# EAGLE design Grove - High Temperature Sensor v1.0 (EAGLE 6.4)
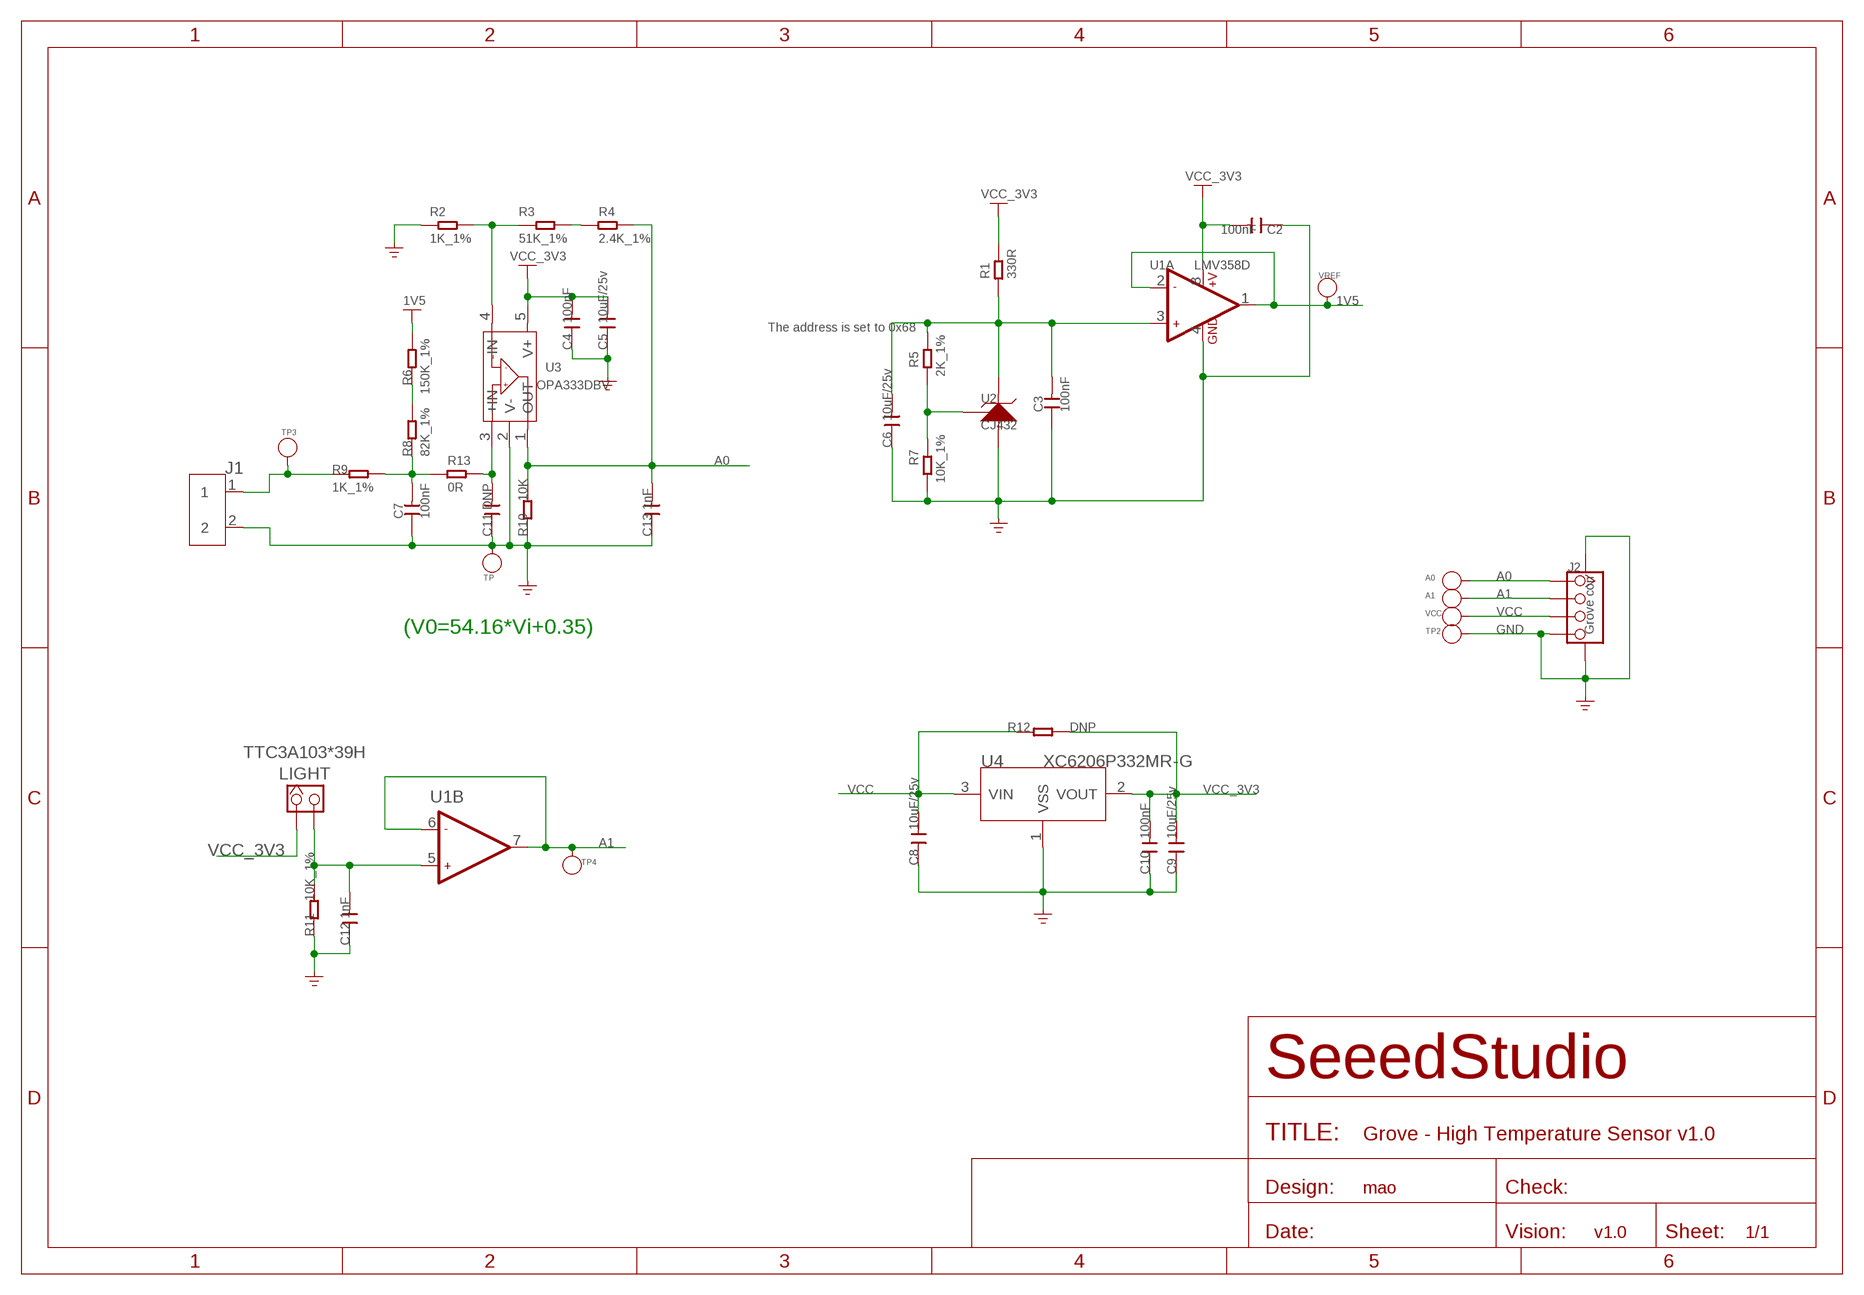
[diagram p0: schematic, sheet 1]

## Parts
A0  TP3  PAD-TEST-POINT'4545'  [TP_4545]
A1  TP3  PAD-TEST-POINT'4545'  [TP_4545]
C2  100nF  C-0603  [C0603]
C3  100nF  C-0603  [C0603]
C4  100nF  C-0603  [C0603]
C5  10uF/25v  C-0805  [C0805]
C6  10uF/25v  C-0805  [C0805]
C7  100nF  C-0603  [C0603]
C8  10uF/25v  C-0805  [C0805]
C9  10uF/25v  C-0805  [C0805]
C10  100nF  C-0603  [C0603]
C11  DNP  C-0603  [C0603]
C12  1nF  C-0603  [C0603]
C13  1nF  C-0603  [C0603]
J1  SCREW-TERMINAL-2P'3.5'  [2P-3.5]
J2  Grove con  TWIG-4P-2.0-SMD-FEMALE-REINFORCE'DD'  [4P-SMD-2.0]
LIGHT  TTC3A103*39H  HEADER_1X2_2.54  [CK_1*2]
R1  330R  R-0603  [R0603]
R2  1K_1%  R-0603  [R0603]
R3  51K_1%  R-0603  [R0603]
R4  2.4K_1%  R-0603  [R0603]
R5  2K_1%  R-0603  [R0603]
R6  150K_1%  R-0603  [R0603]
R7  10K_1%  R-0603  [R0603]
R8  82K_1%  R-0603  [R0603]
R9  1K_1%  R-0603  [R0603]
R10  10K  R-0603  [R0603]
R11  10K_1%  R-0603  [R0603]
R12  DNP  R-0603  [R0603]
R13  0R  R-0603  [R0603]
TP  PAD-TEST-POINT'4545'  [TP_4545]
TP2  PAD-TEST-POINT'4545'  [TP_4545]
TP3  PAD-TEST-POINT'4545'  [TP_4545]
TP4  PAD-TEST-POINT'4545'  [TP_4545]
U1  LMV358D  [SO08]
U2  CJ432  REFERENCE-SOURCE  [SOT23]
U3  OPA333DBV  [SOT23-5]
U4  XC6206P332MR-G  XC6206MR  [SOT23]
VCC  TP2  PAD-TEST-POINT'4545'  [TP_4545]
VREF  TP4  PAD-TEST-POINT'4545'  [TP_4545]

## Nets
1V5: R6.2 U1.1(A:OUT1) U1.2(A:-IN1) VREF.T ; supply symbol labelled POWER_BAR
A0: A0.T C13.2 J2.1 R4.1 R10.2 U3.1(OUT)
A1: A1.T J2.2 TP4.T U1.6(B:-IN2) U1.7(B:OUT2)
GND: C2.1 C3.1 C4.1 C5.1 C6.1 C7.1 C8.1 C9.1 C10.1 C11.1 C12.1 C13.1 J1.2 J2.4 J2.SS1 J2.SS2 R2.2 R7.2 R10.1 R11.1 TP2.T TP.T U1.4(A:GND) U2.3(A) U3.2(V-) U4.1(VSS)
N$1: C7.2 R8.1 R9.2 R13.2
N$2: R2.1 R3.2 U3.4(-IN)
N$3: J1.1 R9.1 TP3.T
N$4: R3.1 R4.2
N$5: C12.2 LIGHT.2 R11.2 U1.5(B:+IN2)
N$6: R6.1 R8.2
N$7: C11.2 R13.1 U3.3(+IN)
N$22: R5.2 R7.1 U2.1(R)
VCC: C8.2 J2.3 R12.1 U4.3(VIN) VCC.T
VCC_3V3: C2.2 C4.2 C5.2 C9.2 C10.2 LIGHT.1 R1.1 R12.2 U1.8(A:+V) U3.5(V+) U4.2(VOUT) ; supply symbol labelled POWER_BAR
VREF: C3.2 C6.2 R1.2 R5.1 U1.3(A:+IN1) U2.2(K)

## Notes on the sheet
- The address is set to 0x68
- (V0=54.16*Vi+0.35)
- mao
- v1.0

## Library data of the parts
A0 A1 TP TP2-TP4 VCC VREF = Discrete:PAD-TEST-POINT; PARTNO: DNP
C2-C13 = Discrete:C*: Ceramic Capacitors
J1 = Connector :SCREW-TERMINAL-2P
J2 = Connector :TWIG-4P-2.0-SMD-FEMALE-REINFORCE
LIGHT = CONNECTER:HEADER_1X2
R1-R13 = Discrete:R*
U1 = IC:LMV358: General purpose LOW Voltage, Rail-to-Rail Output Amplifiers http://www.fairchildsemi.com/ds/LM/LMV358.pdf
U2 = For_Test_Albert_v6:REFERENCE-SOURCE: CJ432,AZ432 or other Adjustable Reference Source
U3 = IC:OPA333: 1.8V,Micro power CMOS oprational amplifiers Zero-Drift Series http://www.ti.com.cn/cn/lit/ds/symlink/opa333.pdf
U4 = IC:XC6206: LOW ESR Cap.Compatible Positive Voltage Regulators

## Net classes
0 default: width 0.152 mm, drill 0.305 mm, clearance 0.152 mm
1 pwr: width 0.152 mm, drill 0.305 mm, clearance 0.152 mm

## Board
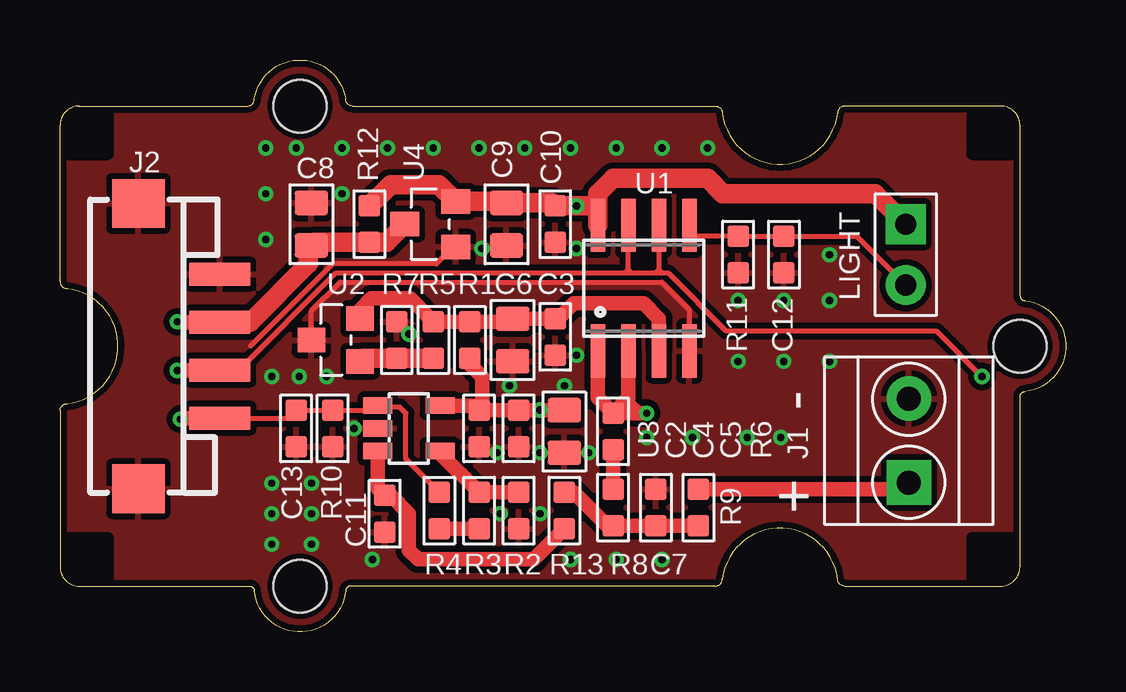
[diagram p1: board, top side]
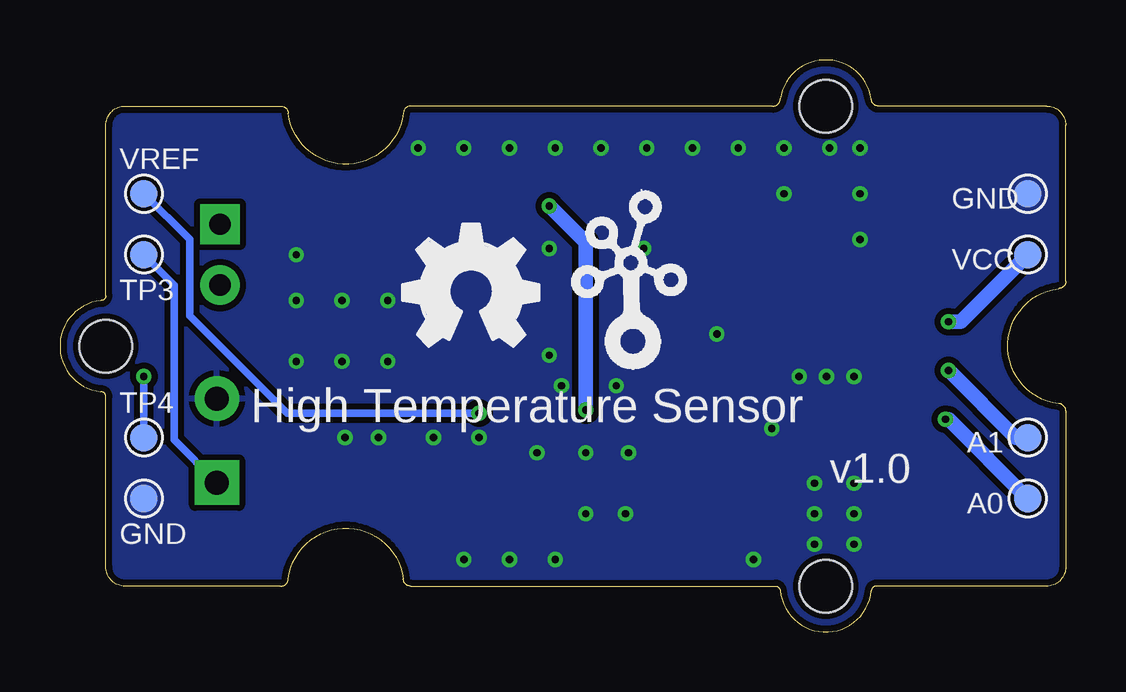
[diagram p2: board, bottom side, seen from below]

Size 41.91 x 23.83 mm. Coordinates in mm from the lower left corner, seen from the top.
Copper layers (1*16): Top 0.035mm / dielectric 1.5mm / Bottom 0.035mm
Design rules "SeeedStudio_DRU_no_angle_20130527 *": minimum track width 6mil, minimum drill 12mil, track to track 6mil, track to pad 6mil, pad to pad 6mil, via to via 6mil, smd to smd 0mil, copper to edge 10mil, drill to drill 10mil, minimum pad ring 10mil, minimum via ring 6mil, stop-mask expansion 2mil, vias tented up to drill 100mil, thermal gap 10mil

### Footprints (pad centres in the part's own frame; a part is rotated, then mirrored left to right if it is on the bottom)
TP_4545 = smd 1.143 x 1.143: T 0,0
C0603 = smd 0.889 x 0.889: 1 -0.762,0; 2 0.762,0
C0805 = smd 1.016 x 1.397: 1 -0.889,0; 2 0.889,0
2P-3.5 = drill 1 pad 1.85 square: 1 -1.75,0 | drill 1 pad 1.85: 2 1.75,0
4P-SMD-2.0 = smd 0.965 x 2.54: 1 -3,0; 2 -1,0; 3 1,0; 4 3,0 | smd 2.032 x 2.184: SS1 -5.946,3.4; SS2 5.946,3.4
CK_1*2 = drill 0.889 pad 1.651 square: 1 0,1.27 | drill 0.889 pad 1.651: 2 0,-1.27
R0603 = smd 0.889 x 0.889: 1 -0.762,0; 2 0.762,0
SO08 = smd 0.61 x 2.21: 1 -1.905,-2.616; 2 -0.635,-2.616; 3 0.635,-2.616; 4 1.905,-2.616; 5 1.905,2.616; 6 0.635,2.616; 7 -0.635,2.616; 8 -1.905,2.616
SOT23 = smd 1.016 x 1.143: 1 -0.889,-1.016; 2 0.889,-1.016; 3 0,1.016
SOT23-5 = smd 0.69 x 1.2: 1 -0.95,-1.3; 2 0,-1.3; 3 0.95,-1.3; 4 0.95,1.3; 5 -0.95,1.3
SOT23' = smd 1.016 x 1.2: 1 -0.95,-1.06; 2 0.95,-1.06; 3 0,1.06
GROVE-2CONNECTOR-SMD = hole 2.2: -10,-10; -10,10; 20,0

### Placement (x,y rotation side)
A0  1.59,5.56 0 bottom
A1  1.59,8.1 0 bottom
C2  17.46,8.48 90 top
C3  20.64,12.29 90 top
C4  19.11,8.48 90 top
C5  21.02,8.35 90 top
C6  18.86,12.16 90 top
C7  24.83,5.18 270 top
C8  10.47,16.99 270 top
C9  18.6,16.99 90 top
C10  20.64,16.99 90 top
C11  13.52,4.92 90 top
C12  30.16,15.72 90 top
C13  9.84,8.48 90 top
J1  35.37,7.97 90 top
J2  6.66,11.91 90 top
LIGHT  35.24,15.72 0 top
R1  17.08,12.16 90 top
R2  19.11,5.05 270 top
R3  17.46,5.05 90 top
R4  15.81,5.05 270 top
R5  15.55,12.16 270 top
R6  23.05,8.35 90 top
R7  14.03,12.16 90 top
R8  23.05,5.18 90 top
R9  26.6,5.18 270 top
R10  11.36,8.48 90 top
R11  28.26,15.72 90 top
R12  12.89,16.99 90 top
R13  21.02,5.05 90 top
TP  38.41,5.56 0 bottom
TP2  1.59,18.26 0 bottom
TP3  38.41,15.72 0 bottom
TP4  38.41,8.1 0 bottom
U1  24.32,14.32 0 top
U2  11.49,12.16 90 top
U3  14.54,8.48 270 top
U4  XC6206P332MR-G  [SOT23']  15.43,16.99 90 top
U$9  [GROVE-2CONNECTOR-SMD]  20,11.91 0 top
U$11  [TWIGLOGO]  18.09,11.91 0 bottom
U$12  [OSHW_FILLX200_NOTEXT]  27.62,11.91 0 bottom
VCC  1.59,15.72 0 bottom
VREF  38.41,18.26 0 bottom

### Tracks (layer width: path | path; a pad name or v marks a point on that pad's centre or on a via)
1V5  (via drill 0.3 pad 0.64)
  Top 0.61: U1.2 23.68,9.75 | 23.68,9.75 R6.2 | U1.1 22.41,9.75 R6.2 | R6.2 23.68,9.11 | 24.06,9.11 v24.45,9.11 | 23.68,9.5 23.68,9.11 | 23.68,9.75 23.68,9.5 | 23.68,9.5 24.06,9.11 | 24.06,9.11 23.68,9.11
  Bottom 0.305: v24.45,9.11 32.45,9.11 36.51,13.18 36.51,16.35 VREF.T
A0  (via drill 0.3 pad 0.64)
  Top 0.203: R10.2 13.05,9.24 U3.1 13.3,9.37 14.16,9.37 14.41,9.11 14.41,7.21 R4.1 | 11.03,8.91 R10.2 | R10.2 C13.2 9.84,8.91 J2.1
  Top 0.61: J2.1 5.06,8.91 v5.01,8.86
  Bottom 0.61: v5.01,8.86 4.89,8.86 A0.T
A1  (via drill 0.3 pad 0.64)
  Top 0.203: J2.2 7.44,10.91 11.49,14.96 23.56,14.96 | 23.56,14.96 23.81,14.96 | 23.81,14.96 24.83,14.96 | 24.83,14.96 24.95,14.96 | 23.68,15.08 U1.7 | 23.68,15.08 23.56,14.96 | 23.68,15.08 23.81,14.96 | U1.6 24.95,15.08 | 24.95,15.08 24.95,14.96 | 25.08,14.96 25.33,14.96 27.75,12.54 36.51,12.54 v38.41,10.64 | 24.95,15.08 25.08,14.96 | 24.95,15.08 24.83,14.96 | 24.95,14.96 25.08,14.96
  Top 0.61: v4.89,10.89 6.65,10.89 J2.2
  Bottom 0.305: v38.41,10.64 TP4.T
  Bottom 0.61: A1.T 2.09,8.1 v4.89,10.89
GND  (via drill 0.3 pad 0.64)
  Top 0.203: U4.1 16.38,16.04 15.68,15.34 11.36,15.34 7.94,11.91 | U2.3 10.47,13.38 11.67,14.58 25.08,14.58 26.22,13.43 U1.4
  Top 0.406: R7.2 v14.54,12.42
  other vias: 8.57,18.26 8.57,16.35 8.57,20.16 9.84,20.16 11.74,20.16 11.74,18.26 13.65,20.16 15.55,20.16 17.46,20.16 19.36,20.16 17.59,15.97 21.52,15.97 21.27,20.16 23.18,20.16 25.08,20.16 26.98,20.16 28.26,13.81 30.16,13.81 28.26,11.27 30.16,11.27 28.64,8.1 30.03,8.1 26.35,8.1 24.45,8.1 22.03,7.46 20,7.46 18.22,7.46 12.25,8.48 10.47,6.19 10.47,4.92 10.47,3.65 13.02,3.02 20,4.92 18.35,4.92 21.27,3.02 23.18,3.02 25.08,3.02 9.97,10.64 8.82,10.64 11.11,10.64 8.82,6.19 8.82,4.92 8.82,3.65 32.06,13.81 32.06,11.27 32.06,15.72 18.73,10.26 21.02,10.26 21.52,11.53
  pour Top (isolate 0.254): -0.95,23.97 42.86,23.97 42.86,-0.79 -0.95,-0.79
  pour Bottom (isolate 0.254): -0.95,23.97 42.86,23.97 42.86,-0.79 -0.95,-0.79
N$1
  Top 0.61: R13.2 21.4,5.81 22.79,4.42 R8.1 C7.2 R9.2
N$2
  Top 0.61: U3.4 15.84,7.43 R3.2 R2.1
N$3
  Top 0.61: R9.1 35.09,5.94 J1.1
  Bottom 0.305: TP3.T 37.14,14.45 37.14,8 J1.1
N$4
  Top 0.61: R4.2 R3.1
N$5
  Top 0.203: U1.5 26.22,16.61 26.35,16.48 R11.2 C12.2 33.21,16.48 LIGHT.2
N$6
  Top 0.61: R8.2 R6.1
N$7
  Top 0.61: U3.3 13.24,5.97 C11.2 13.78,5.69 14.54,4.92 14.54,3.4 14.92,3.02 19.75,3.02 R13.1
N$22
  Top 0.813: R5.2 R7.1 12.63,11.4 U2.1
VCC  (via drill 0.3 pad 0.64)
  Top 0.61: J2.3 4.9,12.91 v4.89,12.92
  Top 0.813: U4.3 13.61,16.23 R12.1 10.6,16.23 C8.2 10.35,15.97 10.35,15.34 7.92,12.91 J2.3
  Bottom 0.61: v4.89,12.92 4.38,12.92 VCC.T
VCC_3V3  (via drill 0.3 pad 0.64)
  Top 0.61: U3.5 17.27,9.43 C2.2 17.59,9.24 | 17.59,9.24 C4.2 v20,9.24 C5.2 | R1.1 17.08,11.15 17.59,10.64 17.59,9.24
  Top 0.813: R12.2 13.78,18.64 15.79,18.64 U4.2 18.54,17.94 C9.2 20.51,17.88 C10.2 v21.52,17.75 22.16,17.75 22.41,17.5 | 22.41,17.5 U1.8 | 22.41,17.5 22.41,18.26 23.05,18.89 26.98,18.89 27.62,18.26 33.97,18.26 LIGHT.1
  Bottom 0.61: v20,9.24 20,16.23 v21.52,17.75
VREF
  Top 0.61: U2.2 12.51,13.43 12.97,13.89 14.59,13.89 R5.1 R1.2 18.73,12.92 C6.2 C3.2 20.76,13.05 21.4,13.69 24.32,13.69 24.95,13.05 U1.3

### Text on the board
tPlace: - | +
bPlace: GND | High Temperature Sensor | v1.0 | GND
tEnhance: Top Enhance 0.25~0.28mm
bEnhance: Bottom Enhance
bEnHoles: Holes on Bottom Enhance | All Holes are 70mil diameter